# Altium schematic sheet IMU_MPU9250.SchDoc
size 203 x 127 mm
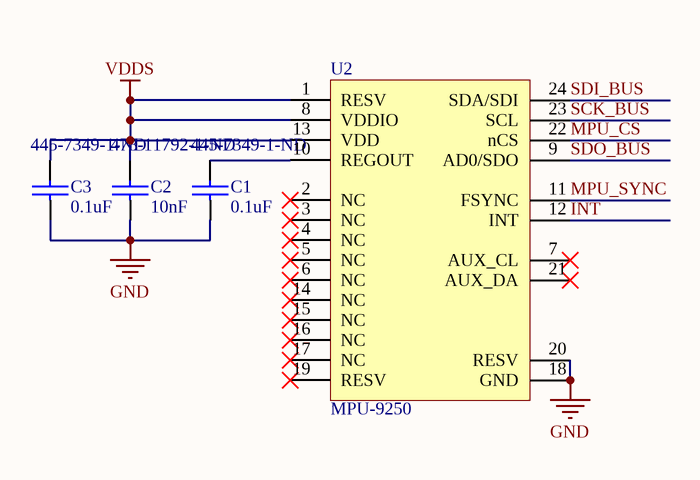
[diagram p0: IMU_MPU9250.SchDoc]

## Parts
C1  Supplier Part Number 1: 445-7349-1-ND  [0402[IMP]]  (hidden comment: 0.1uF)
C2  Supplier Part Number 1: 478-11792-1-ND  [0402[IMP]]  (hidden comment: 10nF)
C3  Supplier Part Number 1: 445-7349-1-ND  [0402[IMP]]  (hidden comment: 0.1uF)
U2  MPU-9250  [QFN-24-3mmx3mm]

## Nets
GND: C1.2 C2.2 C3.2 U2.18(GND) U2.20(RESV)
VDDS: C2.1 C3.1 U2.1(RESV) U2.8(VDDIO) U2.13(VDD)
INT: U2.12(INT)
MPU_CS: U2.22(nCS)
MPU_SYNC: U2.11(FSYNC)
SCK_BUS: U2.23(SCL)
SDI_BUS: U2.24(SDA/SDI)
SDO_BUS: U2.9(AD0/SDO)
NetC1_1: C1.1 U2.10(REGOUT)

Not connected (* = marked no-connect by the designer): U2 2(NC)* 3(NC)* 4(NC)* 5(NC)* 6(NC)* 7(AUX_CL)* 14(NC)* 15(NC)* 16(NC)* 17(NC)* 19(RESV)* 21(AUX_DA)*

## Library data of the parts
C1-C3 = CAPACITOR: VOLTAGE: CMAX; CURRENT: CIMAX; KNEE: CBMAX; PSpiceTemplate: C^@REFDES %1 %2 ?TOLERANCE|C^@REFDES| @VALUE ?IC/IC=@IC/ TC=@TC1,@TC2 ?TOLERANCE|\n.model C^@REFDES CAP C=1 DEV=@TOLERANCE%|; DIST: FLAT; SLOPE: CSMAX; MAX_TEMP: CTMAX; TC1: 0; CLASS: DISCRETE; TC2: 0; Supplier 1: Digi-Key
  C1 C3: Value: 0.1uF
  C2: Value: 10nF